# Altium schematic sheet Control.SchDoc
size A
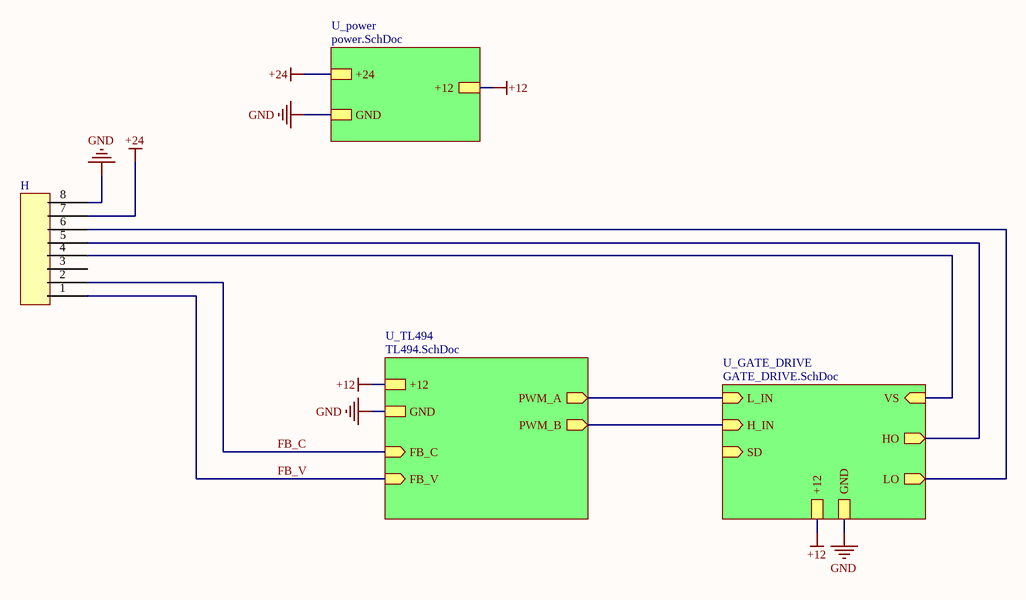
[diagram p0: Control.SchDoc]

## Parts
H  pin_header_8pin  [pin_header8]  (value not drawn)

## Sub-sheets
U_GATE_DRIVE = GATE_DRIVE.SchDoc: GND, +12, VS (in), L_IN (in), SD (in), HO (out), LO (out), H_IN (in)
U_power = power.SchDoc: GND, +24, +12
U_TL494 = TL494.SchDoc: GND, +12, PWM_A (out), PWM_B (out), FB_V (in), FB_C (in)

## Nets
+12: sheet U_GATE_DRIVE/+12, sheet U_power/+12, sheet U_TL494/+12
+24: H.7 ; sheet U_power/+24
GND: H.8 ; sheet U_GATE_DRIVE/GND, sheet U_power/GND, sheet U_TL494/GND
FB_C: H.2 ; sheet U_TL494/FB_C
FB_V: H.1 ; sheet U_TL494/FB_V
NetH_4: H.4 ; sheet U_GATE_DRIVE/VS
NetH_5: H.5 ; sheet U_GATE_DRIVE/HO
NetH_6: H.6 ; sheet U_GATE_DRIVE/LO
(unnamed): sheet U_GATE_DRIVE/L_IN, sheet U_TL494/PWM_A
(unnamed): sheet U_GATE_DRIVE/H_IN, sheet U_TL494/PWM_B

Not connected (* = marked no-connect by the designer): H 3